# EAGLE design untitled (EAGLE 9.5.2)
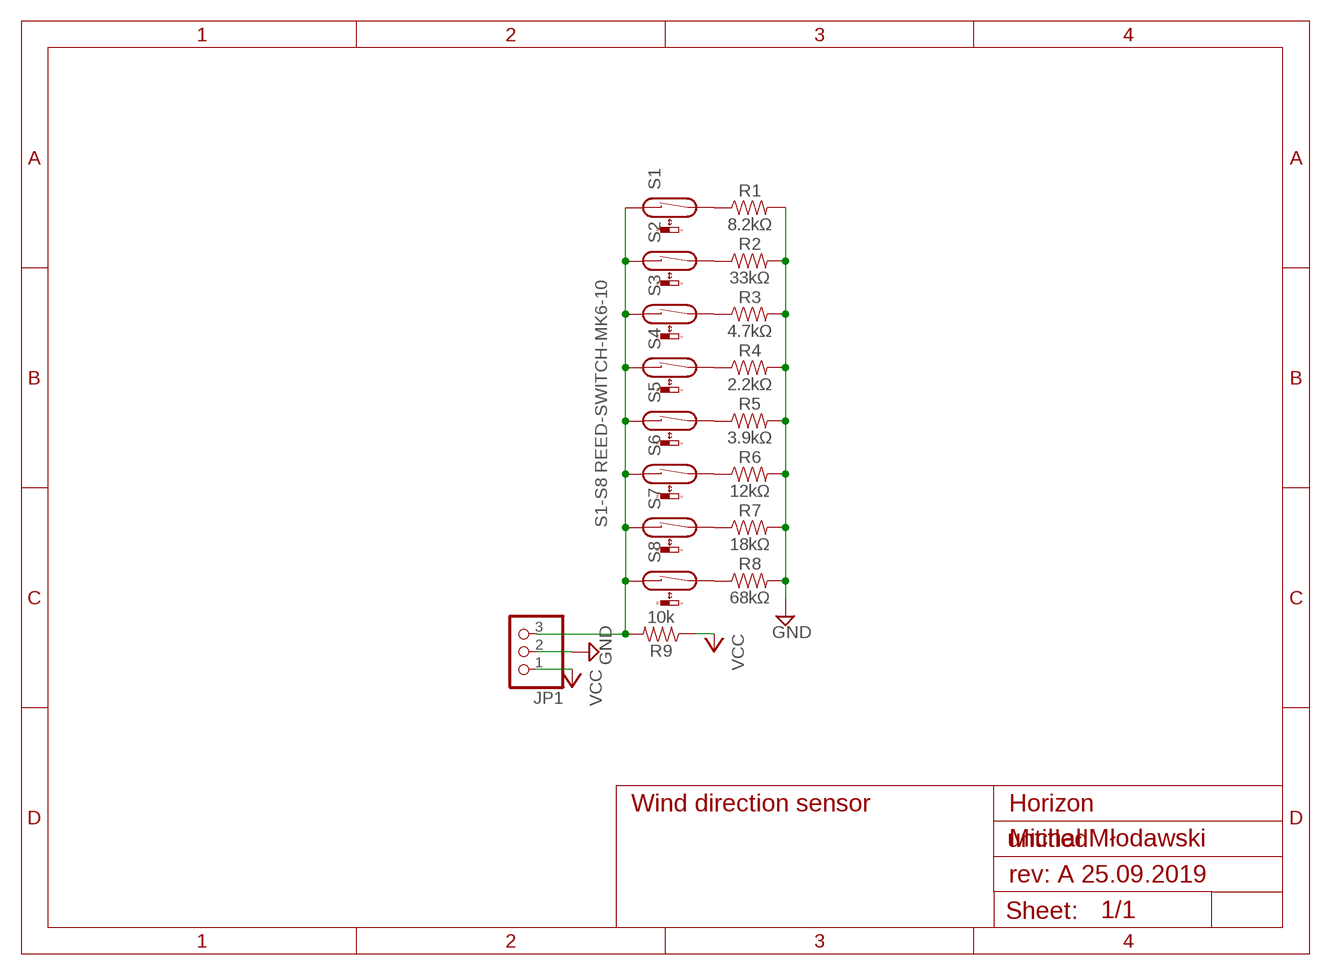
[diagram p0: schematic, sheet 1]

## Parts
JP1  PINHD-1X3  [1X03]
R1  8.2kΩ  1KOHM-HORIZ-1/4W-1%  [AXIAL-0.3]
R2  33kΩ  1KOHM-HORIZ-1/4W-1%  [AXIAL-0.3]
R3  4.7kΩ  1KOHM-HORIZ-1/4W-1%  [AXIAL-0.3]
R4  2.2kΩ  1KOHM-HORIZ-1/4W-1%  [AXIAL-0.3]
R5  3.9kΩ  1KOHM-HORIZ-1/4W-1%  [AXIAL-0.3]
R6  12kΩ  1KOHM-HORIZ-1/4W-1%  [AXIAL-0.3]
R7  18kΩ  1KOHM-HORIZ-1/4W-1%  [AXIAL-0.3]
R8  68kΩ  1KOHM-HORIZ-1/4W-1%  [AXIAL-0.3]
R9  10k  1KOHM-HORIZ-1/4W-1%  [AXIAL-0.3]
S1  REED-SWITCH-MK6-10  [MK6-10]
S2  REED-SWITCH-MK6-10  [MK6-10]
S3  REED-SWITCH-MK6-10  [MK6-10]
S4  REED-SWITCH-MK6-10  [MK6-10]
S5  REED-SWITCH-MK6-10  [MK6-10]
S6  REED-SWITCH-MK6-10  [MK6-10]
S7  REED-SWITCH-MK6-10  [MK6-10]
S8  REED-SWITCH-MK6-10  [MK6-10]

## Nets
GND: JP1.2 R1.P$2 R2.P$2 R3.P$2 R4.P$2 R5.P$2 R6.P$2 R7.P$2 R8.P$2
N$1: R1.P$1 S1.2
N$2: R2.P$1 S2.2
N$3: R3.P$1 S3.2
N$4: R4.P$1 S4.2
N$5: R5.P$1 S5.2
N$6: R6.P$1 S6.2
N$7: R7.P$1 S7.2
N$8: R8.P$1 S8.2
N$10: JP1.3 R9.P$2 S1.1 S2.1 S3.1 S4.1 S5.1 S6.1 S7.1 S8.1
VCC: JP1.1 R9.P$1

## Notes on the sheet
- S1-S8 REED-SWITCH-MK6-10
- Wind direction sensor | Horizon
- Michał Młodawski
- rev: A 25.09.2019

## Library data of the parts
JP1 = pinhead:PINHD-1X3: PIN HEADER
R1-R9 = SparkFun-Resistors:1KOHM: 1kΩ resistor A resistor is a passive two-terminal electrical component that implements electrical resistance as a circuit element. Resistors act to reduce current flow, and, at the same time, act to lower voltage levels within circuits. - Wikipedia; PROD_ID: RES-12182; VALUE: 1k
S1-S8 = switch-reed:REED-SWITCH-: Reed Sensor; OC_FARNELL: unknown

## Board
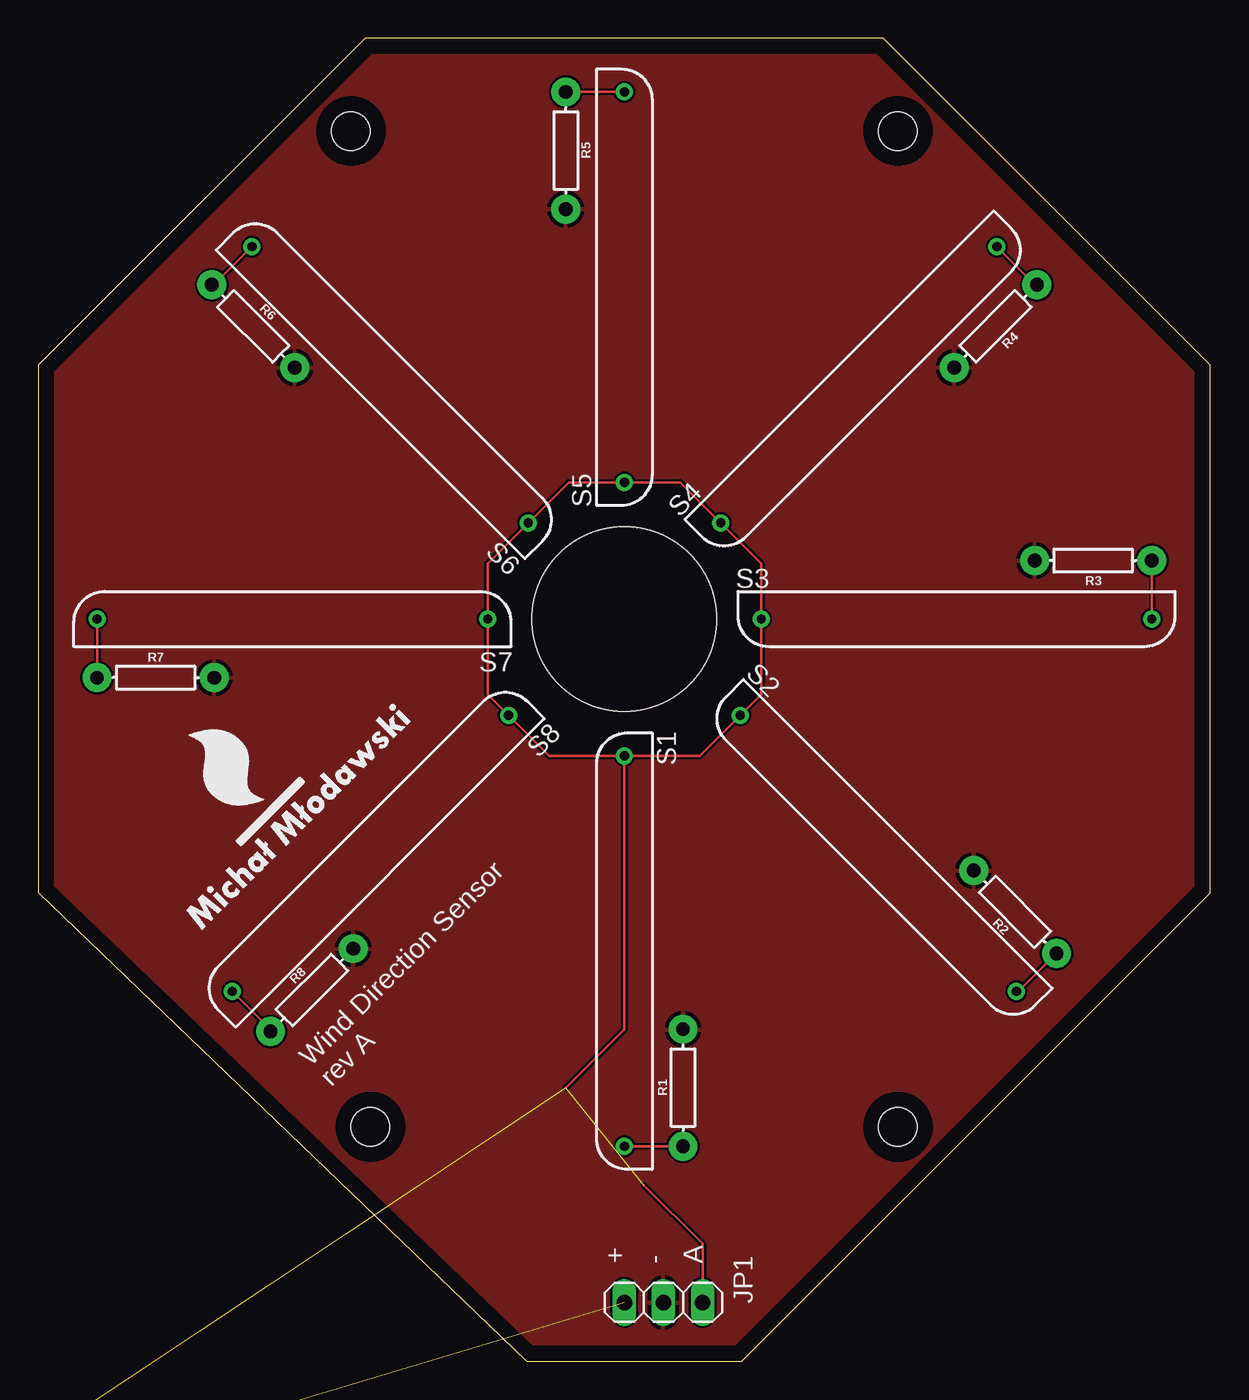
[diagram p1: board, top side]

Size 76.18 x 86.03 mm. Coordinates in mm from the lower left corner, seen from the top.
Outline: 54.94,86.03 21.26,86.03 0,64.77 0,30.48 31.75,0 45.72,0 76.18,30.46 76.18,64.79 54.94,86.03
Copper layers (1*16): Top 0.035mm / dielectric 1.5mm / Bottom 0.035mm
Design rules "default": minimum track width 6mil, minimum drill 0.35mm, track to track 6mil, track to pad 6mil, pad to pad 6mil, via to via 6mil, smd to smd 6mil, copper to edge 40mil, drill to drill 6mil, minimum pad ring 10mil, minimum via ring 8mil, stop-mask expansion 4mil, vias tented up to drill 0mil, thermal gap 10mil
Holes 12 mm at 38.1,48.26
Holes 2.5 mm at 20.32,80.01 55.88,80.01 55.88,15.24 21.59,15.24

### Footprints (pad centres in the part's own frame; a part is rotated, then mirrored left to right if it is on the bottom)
1X03 = drill 1.016 long: 1 -2.54,0; 2 0,0; 3 2.54,0
AXIAL-0.3 = drill 0.9 pad 1.88: P$1 -3.81,0; P$2 3.81,0
MK6-10 = drill 0.6 pad 1.016: 1 -12.7,0; 2 12.7,0

### Placement (x,y rotation side)
JP1  40.64,3.81 0 top
R1  41.91,17.78 90 top
R2  63.5,29.21 135 top
R3  68.58,52.07 180 top
R4  62.23,67.31 225 top
R5  34.29,78.74 270 top
R6  13.97,67.31 315 top
R7  7.62,44.45 0 top
R8  17.78,24.13 45 top
R9  -17.32,-13.97 0 top  (outside the outline)
S1  38.1,26.67 270 top
S2  54.61,33.02 315 top
S3  59.69,48.26 0 top
S4  53.34,63.5 45 top
S5  38.1,69.85 90 top
S6  22.86,63.5 135 top
S7  16.51,48.26 180 top
S8  21.59,33.02 225 top

### Tracks (layer width: path | path; a pad name or v marks a point on that pad's centre or on a via)
GND
  pour Top: -1.27,86.36 80.01,86.36 80.01,-2.54 81.28,-3.81 -3.81,-3.81 -6.35,-1.27 -6.35,81.28
N$1
  Top 0.152: R1.P$1 S1.2
N$2
  Top 0.152: R2.P$1 63.72,24.04 S2.2
N$3
  Top 0.152: R3.P$1 S3.2
N$4
  Top 0.152: S4.2 64.8,70 R4.P$1
N$5
  Top 0.152: R5.P$1 S5.2
N$6
  Top 0.152: S6.2 11.4,70 R6.P$1
N$7
  Top 0.152: S7.2 R7.P$1
N$8
  Top 0.152: S8.2 15.09,21.56 R8.P$1
N$10  (2 unrouted)
  Top 0.152: 39.37,11.43 43.18,7.62 JP1.3 | S1.1 43,39.37 S2.1 46.99,43.36 S3.1 46.99,51.89 S4.1 41.73,57.15 S5.1 34.47,57.15 S6.1 29.21,51.89 S7.1 29.21,43.36 S8.1 33.2,39.37 S1.1 | S1.1 38.1,21.59 34.29,17.78
VCC  (1 unrouted)

### Text on the board
tPlace: Wind Direction Sensor / rev A | + | - | A